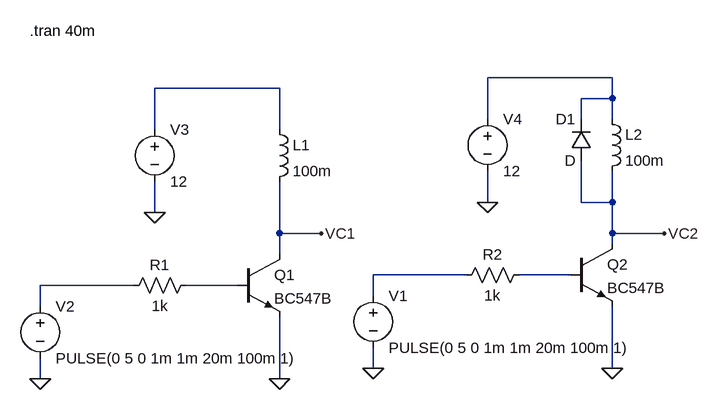
[diagram p0: schematic flyback_diode.asc]
flyback_diode.asc, the LTspice schematic file:
Version 4
SHEET 1 1004 680
WIRE 864 128 672 128
WIRE 352 144 160 144
WIRE 864 160 864 128
WIRE 864 160 816 160
WIRE 672 192 672 128
WIRE 816 192 816 160
WIRE 864 192 864 160
WIRE 160 208 160 144
WIRE 352 208 352 144
WIRE 672 320 672 272
WIRE 816 320 816 256
WIRE 864 320 864 272
WIRE 864 320 816 320
WIRE 160 336 160 288
WIRE 352 368 352 288
WIRE 416 368 352 368
WIRE 864 368 864 320
WIRE 944 368 864 368
WIRE 864 384 864 368
WIRE 352 400 352 368
WIRE 640 432 496 432
WIRE 800 432 720 432
WIRE 128 448 -16 448
WIRE 288 448 208 448
WIRE 496 464 496 432
WIRE -16 480 -16 448
WIRE 496 576 496 544
WIRE 864 576 864 480
WIRE -16 592 -16 560
WIRE 352 592 352 496
FLAG 352 592 0
FLAG 160 336 0
FLAG -16 592 0
FLAG 864 576 0
FLAG 672 320 0
FLAG 496 576 0
FLAG 944 368 VC2
FLAG 416 368 VC1
SYMBOL ind 336 192 R0
SYMATTR InstName L1
SYMATTR Value 100m
SYMATTR SpiceLine Rser=400
SYMBOL npn 288 400 R0
SYMATTR InstName Q1
SYMATTR Value BC547B
SYMBOL Res 224 432 R90
WINDOW 0 0 56 VBottom 2
WINDOW 3 32 56 VTop 2
SYMATTR InstName R1
SYMATTR Value 1k
SYMBOL Voltage -16 464 R0
SYMATTR InstName V2
SYMATTR Value PULSE(0 5 0 1m 1m 20m 100m 1)
SYMBOL Voltage 160 192 R0
SYMATTR InstName V3
SYMATTR Value 12
SYMBOL ind 848 176 R0
SYMATTR InstName L2
SYMATTR Value 100m
SYMATTR SpiceLine Rser=400
SYMBOL npn 800 384 R0
SYMATTR InstName Q2
SYMATTR Value BC547B
SYMBOL Res 736 416 R90
WINDOW 0 0 56 VBottom 2
WINDOW 3 32 56 VTop 2
SYMATTR InstName R2
SYMATTR Value 1k
SYMBOL Voltage 496 448 R0
SYMATTR InstName V1
SYMATTR Value PULSE(0 5 0 1m 1m 20m 100m 1)
SYMBOL Voltage 672 176 R0
SYMATTR InstName V4
SYMATTR Value 12
SYMBOL diode 832 256 R180
WINDOW 0 24 64 Left 2
WINDOW 3 24 0 Left 2
SYMATTR InstName D1
TEXT -32 56 Left 2 !.tran 40m

The netlist it stands for:
* flyback_diode.asc
L1 N002 VC1 100m Rser=400
Q1 VC1 N006 0 0 BC547B
R1 N006 N005 1k
V2 N005 0 PULSE(0 5 0 1m 1m 20m 100m 1)
V3 N002 0 12
L2 N001 VC2 100m Rser=400
Q2 VC2 N004 0 0 BC547B
R2 N004 N003 1k
V1 N003 0 PULSE(0 5 0 1m 1m 20m 100m 1)
V4 N001 0 12
D1 VC2 N001 D
.model D D
.lib standard.dio
.model NPN NPN
.model PNP PNP
.lib standard.bjt
.tran 40m
.backanno
.end